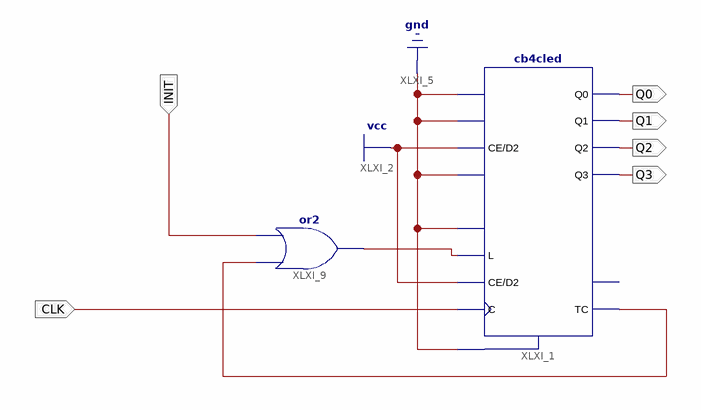
[diagram p0: schematic sheet 1]
// Xilinx ISE schematic p3ej2a.sch (spartan3) as structural Verilog: 2 symbols, 6 ports
module p3ej2a (
  input  CLK,
  input  INIT,
  output Q0,
  output Q1,
  output Q2,
  output Q3
);

  wire XLXN_21, XLXN_24;

  cb4cled XLXI_1 (
    .C(CLK), .CE(1'b1), .CLR(1'b0), .D0(1'b0), .D1(1'b0), .D2(1'b1), .D3(1'b0), .L(XLXN_21), .UP(1'b0),
    .Q0(Q0), .Q1(Q1), .Q2(Q2), .Q3(Q3), .TC(XLXN_24));  // open: CEO
  or XLXI_9 (XLXN_21, XLXN_24, INIT);
endmodule
